# Altium schematic sheet PWM_LOGIC.SchDoc
size 350 x 410 mm
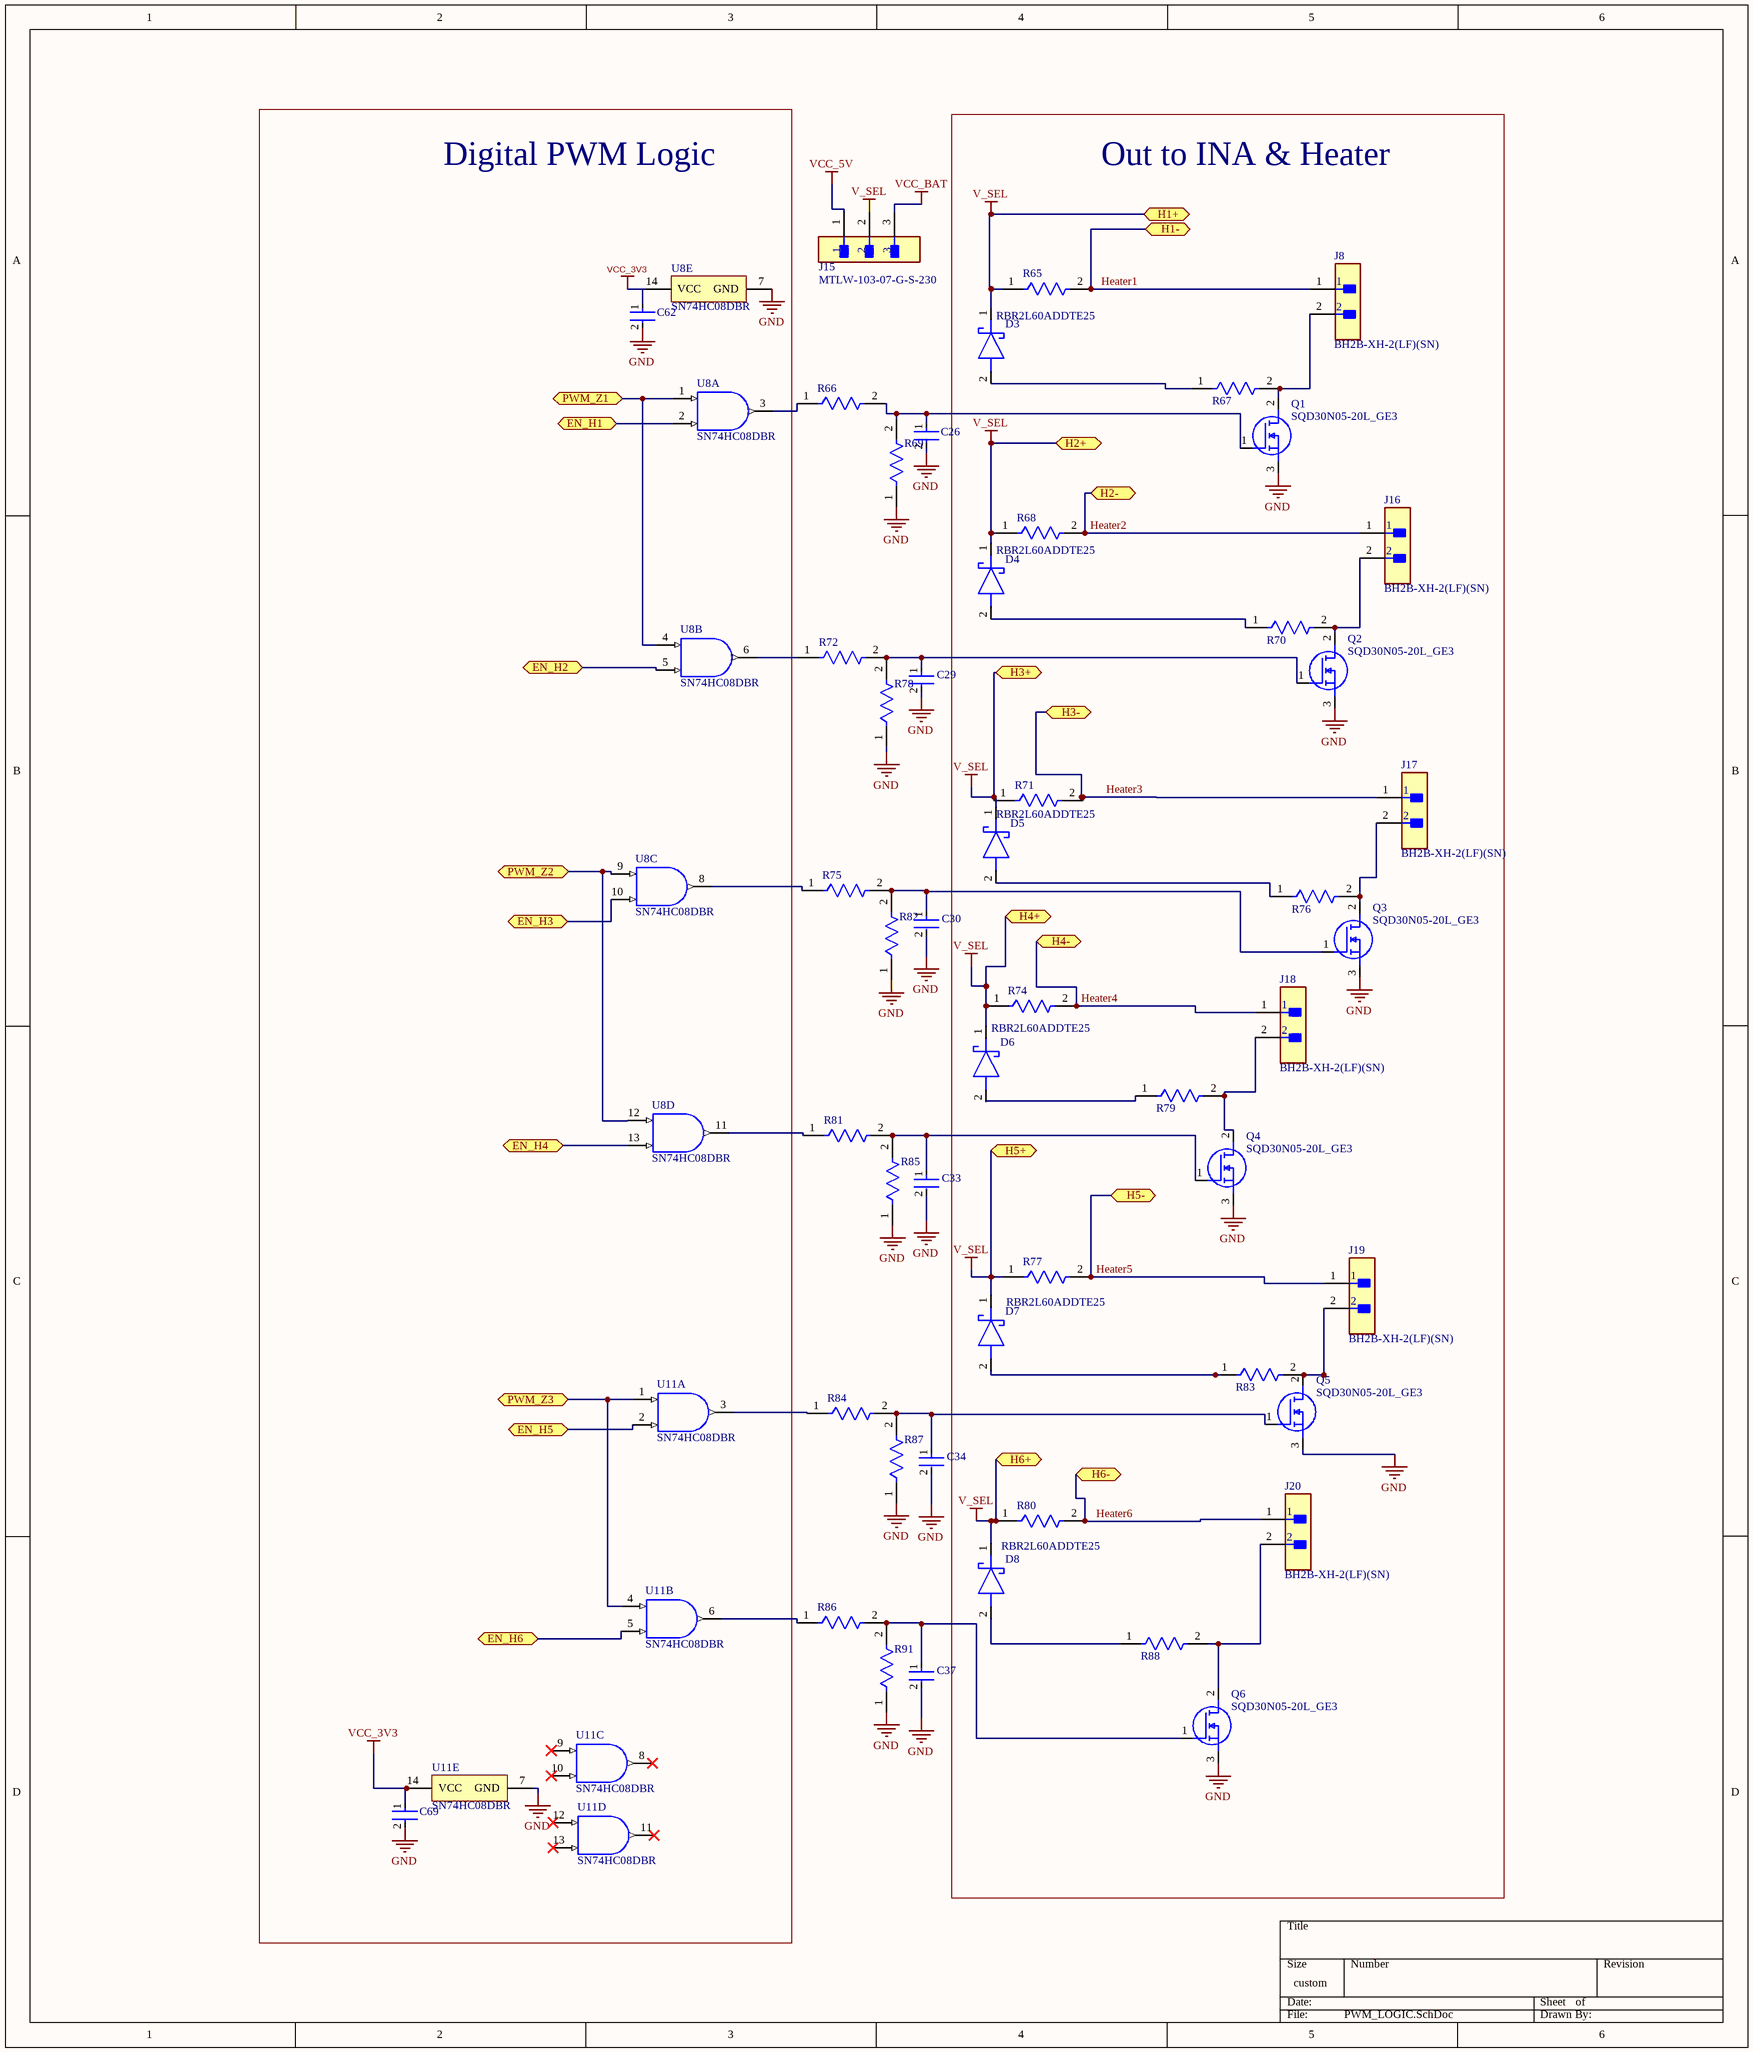
[diagram p0: PWM_LOGIC.SchDoc]

## Parts
C26  C0603C472K3RACAUTO  [FP-C0603C-CF-MFG]  (value not drawn)
C29  C0603C472K3RACAUTO  [FP-C0603C-CF-MFG]  (value not drawn)
C30  C0603C472K3RACAUTO  [FP-C0603C-CF-MFG]  (value not drawn)
C33  C0603C472K3RACAUTO  [FP-C0603C-CF-MFG]  (value not drawn)
C34  C0603C472K3RACAUTO  [FP-C0603C-CF-MFG]  (value not drawn)
C37  C0603C472K3RACAUTO  [FP-C0603C-CF-MFG]  (value not drawn)
C62  GRM033C71A104KE14J  [FP-GRM033-0_03-MFG]  (value not drawn)
C69  GRM033C71A104KE14J  [FP-GRM033-0_03-MFG]  (value not drawn)
D3  RBR2L60ADDTE25  [DIOM5026X220N]
D4  RBR2L60ADDTE25  [DIOM5026X220N]
D5  RBR2L60ADDTE25  [DIOM5026X220N]
D6  RBR2L60ADDTE25  [DIOM5026X220N]
D7  RBR2L60ADDTE25  [DIOM5026X220N]
D8  RBR2L60ADDTE25  [DIOM5026X220N]
J8  BH2B-XH-2(LF)(SN)  [FP-BH2B-XH-2_LF_SN-MFG]
J15  MTLW-103-07-G-S-230  [FP-MTLW-103-07-G-S-230-MFG]
J16  BH2B-XH-2(LF)(SN)  [FP-BH2B-XH-2_LF_SN-MFG]
J17  BH2B-XH-2(LF)(SN)  [FP-BH2B-XH-2_LF_SN-MFG]
J18  BH2B-XH-2(LF)(SN)  [FP-BH2B-XH-2_LF_SN-MFG]
J19  BH2B-XH-2(LF)(SN)  [FP-BH2B-XH-2_LF_SN-MFG]
J20  BH2B-XH-2(LF)(SN)  [FP-BH2B-XH-2_LF_SN-MFG]
Q1  SQD30N05-20L_GE3  [SQD30N0520L_GE3]
Q2  SQD30N05-20L_GE3  [SQD30N0520L_GE3]
Q3  SQD30N05-20L_GE3  [SQD30N0520L_GE3]
Q4  SQD30N05-20L_GE3  [SQD30N0520L_GE3]
Q5  SQD30N05-20L_GE3  [SQD30N0520L_GE3]
Q6  SQD30N05-20L_GE3  [SQD30N0520L_GE3]
R65  CSR1206FT50L0  [FP-CSR1206-IPC_B]  (value not drawn)
R66  RMCF1210FT330R  [FP-RMCF1210-IPC_B]  (value not drawn)
R67  ESR03EZPF75R0  [FP-ESR03-IPC_B]  (value not drawn)
R68  CSR1206FT50L0  [FP-CSR1206-IPC_B]  (value not drawn)
R69  RMCF1206FG10K0  [FP-RMCF1206-MFG]  (value not drawn)
R70  ESR03EZPF75R0  [FP-ESR03-IPC_B]  (value not drawn)
R71  CSR1206FT50L0  [FP-CSR1206-IPC_B]  (value not drawn)
R72  RMCF1210FT330R  [FP-RMCF1210-IPC_B]  (value not drawn)
R74  CSR1206FT50L0  [FP-CSR1206-IPC_B]  (value not drawn)
R75  RMCF1210FT330R  [FP-RMCF1210-IPC_B]  (value not drawn)
R76  ESR03EZPF75R0  [FP-ESR03-IPC_B]  (value not drawn)
R77  CSR1206FT50L0  [FP-CSR1206-IPC_B]  (value not drawn)
R78  RMCF1206FG10K0  [FP-RMCF1206-MFG]  (value not drawn)
R79  ESR03EZPF75R0  [FP-ESR03-IPC_B]  (value not drawn)
R80  CSR1206FT50L0  [FP-CSR1206-IPC_B]  (value not drawn)
R81  RMCF1210FT330R  [FP-RMCF1210-IPC_B]  (value not drawn)
R82  RMCF1206FG10K0  [FP-RMCF1206-MFG]  (value not drawn)
R83  ESR03EZPF75R0  [FP-ESR03-IPC_B]  (value not drawn)
R84  RMCF1210FT330R  [FP-RMCF1210-IPC_B]  (value not drawn)
R85  RMCF1206FG10K0  [FP-RMCF1206-MFG]  (value not drawn)
R86  RMCF1210FT330R  [FP-RMCF1210-IPC_B]  (value not drawn)
R87  RMCF1206FG10K0  [FP-RMCF1206-MFG]  (value not drawn)
R88  ESR03EZPF75R0  [FP-ESR03-IPC_B]  (value not drawn)
R91  RMCF1206FG10K0  [FP-RMCF1206-MFG]  (value not drawn)
U8  SN74HC08DBR  [DB0014A_L]  (parts A,B,C,D,E of 5)
U11  SN74HC08DBR  [DB0014A_L]  (parts A,B,C,D,E of 5)

## Blocks framed on the sheet
Digital PWM Logic: C62 C69 U8 U11
Out to INA & Heater: D3-D8 J8 J16-J20 Q1-Q6 R65 R67 R68 R70 R71 R74 R76 R77 R79 R80 R83 R88

## Ports
EN_H1 (bidir), EN_H2 (bidir), EN_H3 (bidir), EN_H4 (bidir), EN_H5 (bidir), EN_H6 (bidir), H1+ (bidir), H1- (bidir), H2+ (bidir), H2- (bidir), H3+ (bidir), H3- (bidir), H4+ (bidir), H4- (bidir), H5+ (bidir), H5- (bidir), H6+ (bidir), H6- (bidir), PWM_Z1 (bidir), PWM_Z2 (bidir), PWM_Z3 (bidir)

## Nets
GND: C26.2 C29.2 C30.2 C33.2 C34.2 C37.2 C62.2 C69.2 Q1.3(S) Q2.3(S) Q3.3(S) Q4.3(S) Q5.3(S) Q6.3(S) R69.1 R78.1 R82.1 R85.1 R87.1 R91.1 U8.7(GND) U11.7(GND)
V_SEL: D3.1(K) D4.1(K) D5.1(K) D6.1(K) D7.1(K) D8.1(K) J15.2 R65.1 R68.1 R71.1 R74.1 R77.1 R80.1 ; port H2+, port H1+, port H3+, port H4+, port H6+, port H5+
VCC_3V3: C62.1 C69.1 U8.14(VCC) U11.14(VCC)
VCC_5V: J15.1
VCC_BAT: J15.3
EN_H1: U8.2(1B) ; port EN_H1
EN_H2: U8.5(2B) ; port EN_H2
EN_H3: U8.10(3B) ; port EN_H3
EN_H4: U8.13(4B) ; port EN_H4
EN_H5: U11.2(1B) ; port EN_H5
EN_H6: U11.5(2B) ; port EN_H6
Heater1: J8.1 R65.2 ; port H1-
Heater2: J16.1 R68.2 ; port H2-
Heater3: J17.1 R71.2 ; port H3-
Heater4: J18.1 R74.2 ; port H4-
Heater5: J19.1 R77.2 ; port H5-
Heater6: J20.1 R80.2 ; port H6-
PWM_Z1: U8.1(1A) U8.4(2A) ; port PWM_Z1
PWM_Z2: U8.9(3A) U8.12(4A) ; port PWM_Z2
PWM_Z3: U11.1(1A) U11.4(2A) ; port PWM_Z3
NetC26_1: C26.1 Q1.1(G) R66.2 R69.2
NetC29_1: C29.1 Q2.1(G) R72.2 R78.2
NetC30_1: C30.1 Q3.1(G) R75.2 R82.2
NetC33_1: C33.1 Q4.1(G) R81.2 R85.2
NetC34_1: C34.1 Q5.1(G) R84.2 R87.2
NetC37_1: C37.1 Q6.1(G) R86.2 R91.2
NetD3_2: D3.2(A) R67.1
NetD4_2: D4.2(A) R70.1
NetD5_2: D5.2(A) R76.1
NetD6_2: D6.2(A) R79.1
NetD7_2: D7.2(A) R83.1
NetD8_2: D8.2(A) R88.1
NetJ8_2: J8.2 Q1.2(D) R67.2
NetJ16_2: J16.2 Q2.2(D) R70.2
NetJ17_2: J17.2 Q3.2(D) R76.2
NetJ18_2: J18.2 Q4.2(D) R79.2
NetJ19_2: J19.2 Q5.2(D) R83.2
NetJ20_2: J20.2 Q6.2(D) R88.2
NetR66_1: R66.1 U8.3(1Y)
NetR72_1: R72.1 U8.6(2Y)
NetR75_1: R75.1 U8.8(3Y)
NetR81_1: R81.1 U8.11(4Y)
NetR84_1: R84.1 U11.3(1Y)
NetR86_1: R86.1 U11.6(2Y)

Not connected (* = marked no-connect by the designer): U11 8(3Y)* 9(3A)* 10(3B)* 11(4Y)* 12(4A)* 13(4B)*

## Library data of the parts
C26 C29 C30 C33 C34 C37 = CMP-03020-019028-1: C0603 4,700 pF X7R 30ppm/°C 10.00% 25 V; Manufacturer: KEMET; Tolerance: 0.1; Material: Ceramic; Voltage Rating: 25 V; Automotive Grade: Grade 1; Value: 4,700 pF; Height: 0.87mm; Octopart: https://octopart.com/c0603c472k3racauto-kemet-22128797; Temperature Range Low: -55°C; Automotive: Yes; Package: C0603C-CF; Lead Free: Yes; Temperature Characteristic: X7R; Device Class L1: Passive Components; ComponentLink2URL: https://api.kemet.com/component-edge/download/datasheet/C0603C100J5GACAUTO.pdf; ComponentLink2Description: Datasheet; Capacitance: 4,700 pF; RoHS: TRUE; Category: Cap; Device Class L2: Capacitors; Temperature Coefficient: 30ppm/°C; Temperature: -55°C to +125°C; Manufacturer Part Number: C0603C472K3RACAUTO; Temperature Range High: +125°C; Device Class L3: Ceramic Capacitors
C62 C69 = CMP-06035-019237-1: Chip Multilayer Ceramic Capacitors for General Purpose, 0201, 0.10uF, X7S, 22%, 10%, 10V; Capacitance: 100nF; Voltage Rating (DC): 10V; Width: 300um; Tolerance: 10%; Thickness: 300um; Dielectric: X7S; Length: 600um
D3-D8 = RBR2L60ADDTE25: Schottky Diode; Manufacturer_Name: ROHM Semiconductor; Datasheet Link: https://fscdn.rohm.com/en/products/databook/datasheet/discrete/diode/schottky_barrier/rbr2l60addte25-e.pdf; Height: 2.2mm; Manufacturer_Part_Number: RBR2L60ADDTE25; Mouser Part Number: 755-RBR2L60ADDTE25; Mouser Price/Stock: https://www.mouser.co.uk/ProductDetail/ROHM-Semiconductor/RBR2L60ADDTE25?qs=4v%252BiZTmLVHEBMNIM0%2F0JvA%3D%3D
J8 J16-J20 = CMP-17439-000730-1: CONN HEADER VERT 2POS 2.5MM; Voltage Rating (AC): 250V; Number of Positions: 2; Pitch: 2.5mm; Contact Type: Male Pin; Max Operating Temperature: 85°C; Termination: Press-Fit; Connector Type: Header; Flammability Rating: UL94 V-0; Min Operating Temperature: -25°C; Contact Material: Copper Alloy; Series: XH; Lead Free: Lead Free; Fastening Type: Detent; Contact Finish - Mating: TIN; Number of Rows: 1; Insulation Color: Natural; Insulation Material: Nylon; Mount: Through Hole; Contact Shape: Square
J15 = CMP-02766-001679-1: CONN HEADER VERT 3POS 2.54MM; Max Current Rating: 3A; Number of Contacts: 3; Gender: Male; Contact Material: Bronze; Pitch: 2.54mm; Housing Material: Polymer; Contact Plating: Gold; Radiation Hardening: No; Depth: 2.48mm; Packaging: Bulk; Number of Rows: 1; Max Operating Temperature: 125°C; Housing Color: Black; Termination: Solder; Min Operating Temperature: -55°C; Length: 7.62mm; RoHS Compliant: Yes; Orientation: Straight
Q1-Q6 = SQD30N05-20L_GE3: MOSFET (N-Channel); Manufacturer_Name: Vishay; Datasheet Link: https://componentsearchengine.com/Datasheets/2/SQD30N05-20L_GE3.pdf; Height: 2.38mm; Manufacturer_Part_Number: SQD30N05-20L_GE3; Mouser Part Number: 78-SQD30N05-20L_GE3; Mouser Price/Stock: https://www.mouser.co.uk/ProductDetail/Vishay-Semiconductors/SQD30N05-20L_GE3?qs=jHkklCh7amiAA4biOjvVUQ%3D%3D
R65 R68 R71 R74 R77 R80 = CMP-26527-004223-1: General Purpose Thick Film Chip Resistor, 1206, 50mΩ, 1%, 100ppm/°C, 0.5W; Resistance: 50mR; Max Power Dissipation: 500mW; Length: 0.12inch; Package Quantity: 1; Case Code (Imperial): 1206; Series: CSR; Mount: Surface Mount; Temperature Coefficient: 100ppm/°C; Width: 0.061inch; Resistor Type: Thick Film; Max Operating Temperature: 155°C; Case Code (Metric): 3216; Packaging: Tape and Reel; Min Operating Temperature: -55°C; RoHS Compliant: Yes; Radiation Hardening: No; Lead Free: Lead Free; Height: 0.026inch; Tolerance: 1%; Number of Terminations: 2; Contact Plating: Tin; Case/Package: 1206
R66 R72 R75 R81 R84 R86 = CMP-26527-000636-1: 330Ω ±1% 0.5W 1210 Thick Film Chip Resistor AEC-Q200 compliant; Max Power Dissipation: 500mW; Temperature Coefficient: 100ppm/°C; Resistance: 330R; Packaging: Tape and Reel; Case/Package: 1210; Width: 0.098inch; Radiation Hardening: No; Contact Plating: Tin; Features: Automotive AEC-Q200; Series: RMCF; RoHS Compliant: Yes; Resistor Type: Thick Film; Min Operating Temperature: -55°C; Length: 0.126inch; Mount: Surface Mount; Max Operating Temperature: 155°C; Number of Terminations: 2; Tolerance: 1%; Height: 0.028inch
R67 R70 R76 R79 R83 R88 = CMP-08839-029068-1: 75Ω ±1% 0.25W 0603 Anti-Surge Chip Resistor AEC-Q200; Max Power Dissipation: 250mW; Resistance: 75R; Temperature Coefficient: 100ppm/°C; Packaging: Tape and Reel; Min Operating Temperature: -55°C; Case/Package: 0603; Max Operating Temperature: 155°C; Resistor Type: Thick Film; Case Code (Imperial): 0603; Case Code (Metric): 1608; RoHS Compliant: Yes; Tolerance: 1%; Series: ESR; Number of Terminations: 2; Features: Automotive AEC-Q200
R69 R78 R82 R85 R87 R91 = CMP-26527-002036-1: 10kΩ ±1% 0.25W 1206 Thick Film Chip Resistor AEC-Q200 compliant; Max Power Dissipation: 250mW; Resistance: 10kR; Temperature Coefficient: 100ppm/°C; Construction: Rectangular; Contact Plating: Tin; Max Operating Temperature: 155°C; Features: Automotive AEC-Q200; Radiation Hardening: No; Military Standard: Not; RoHS Compliant: Yes; Length: 0.126inch; Number of Terminations: 2; Mount: Surface Mount; Case Code (Imperial): 1206; Case Code (Metric): 3216; Series: RMCF; Width: 0.063inch; Min Operating Temperature: -55°C; Height: 0.028inch; Resistor Type: Thick Film; Packaging: Tape and Reel; Tolerance: 1%; Depth: 1.6mm; Case/Package: 1206
U8 U11 = CMP-0777-00132-3: Quadruple 2-Input Positive-AND Gates, DB0014A, LARGE T&R; Manufacturer: Texas Instruments; Input Type: CMOS; Technology Family: HC; Schmitt Trigger: No; VCC(Max)(V): 6; F @ Nom Voltage(Max)(Mhz): 70; VCC(Min)(V): 2; Bits(#): 4; ICC @ Nom Voltage(Max)(mA): 0.02; Voltage(Nom)(V): 5; tpd @ Nom Voltage(Max)(ns): 28; Rating: Catalog; PackageReference: DB0014A; Operating Temperature Range(C): -40 to 85; Output Type: CMOS; DatasheetVersion: SCLS081F; Generic Part Number: SN74HC08